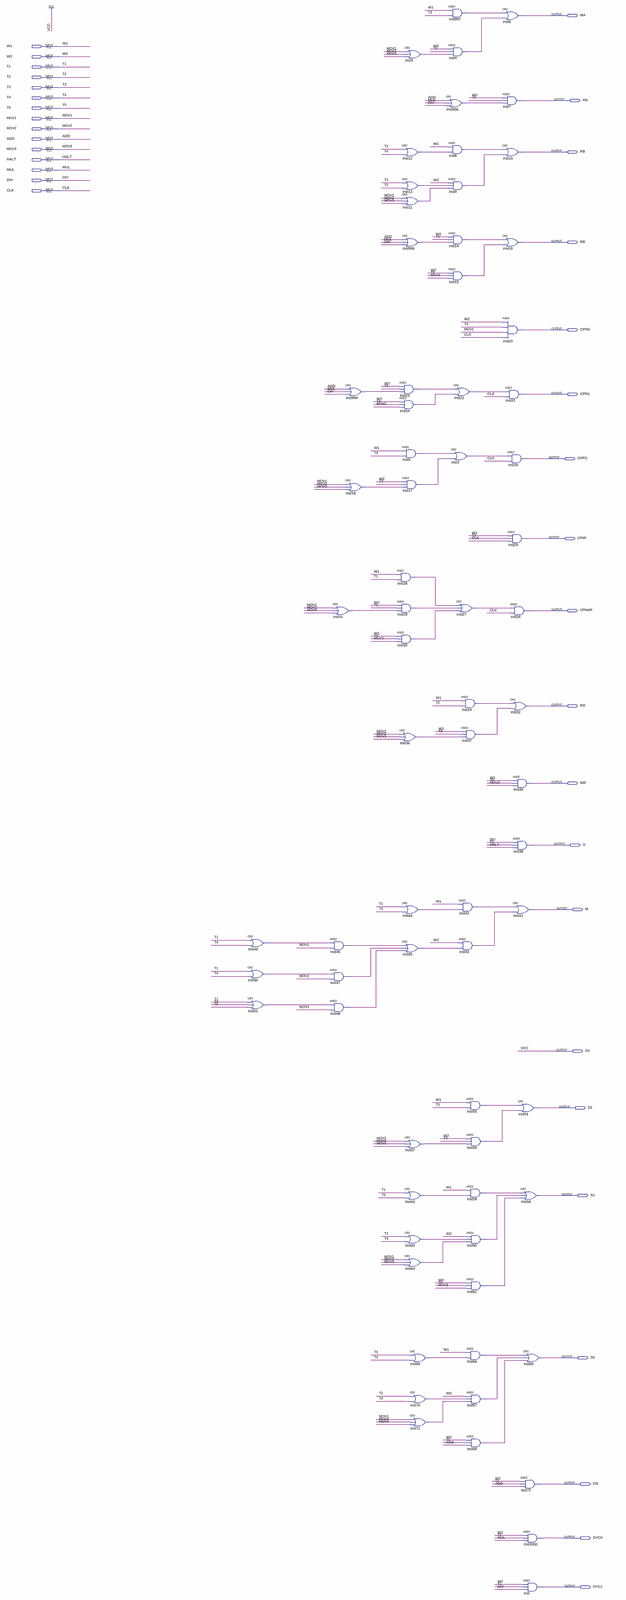
[diagram p0: schematic sheet, whole]
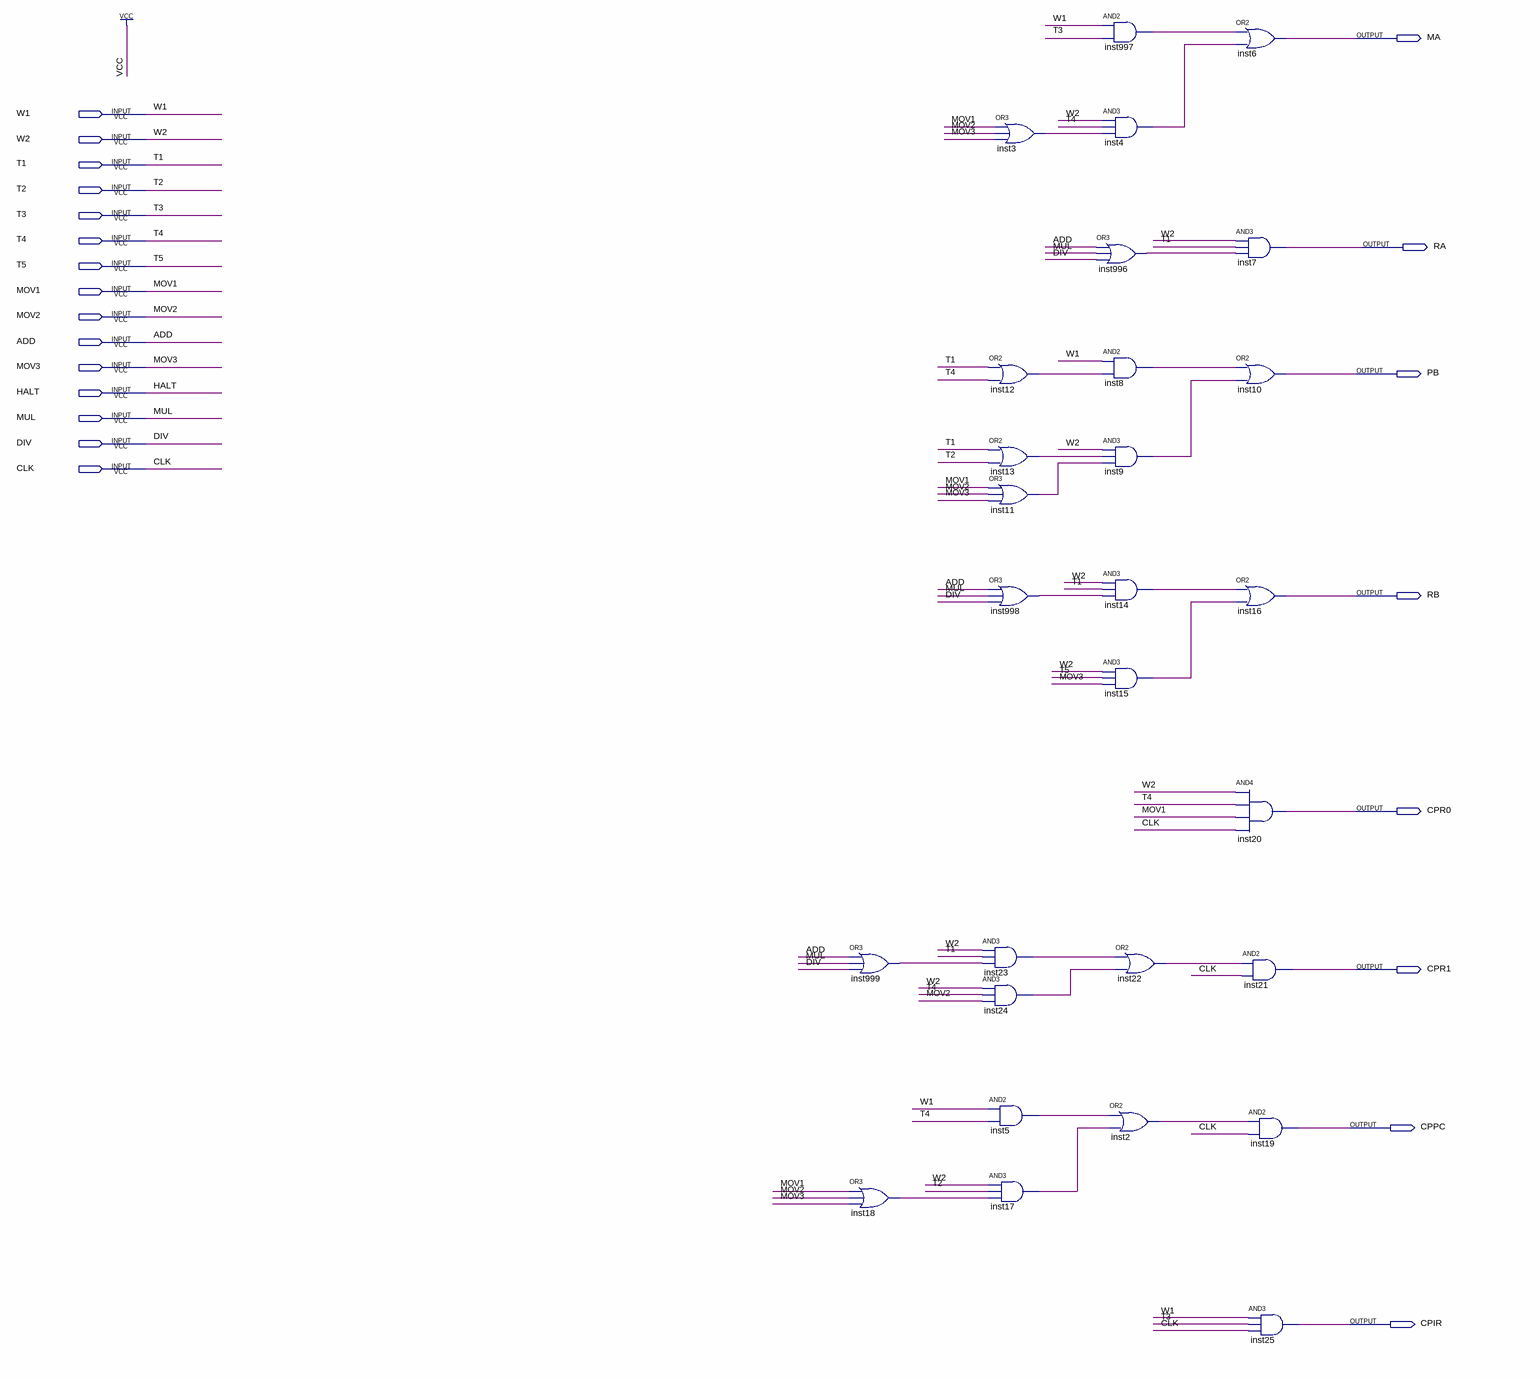
[diagram p1: schematic sheet, upper part]
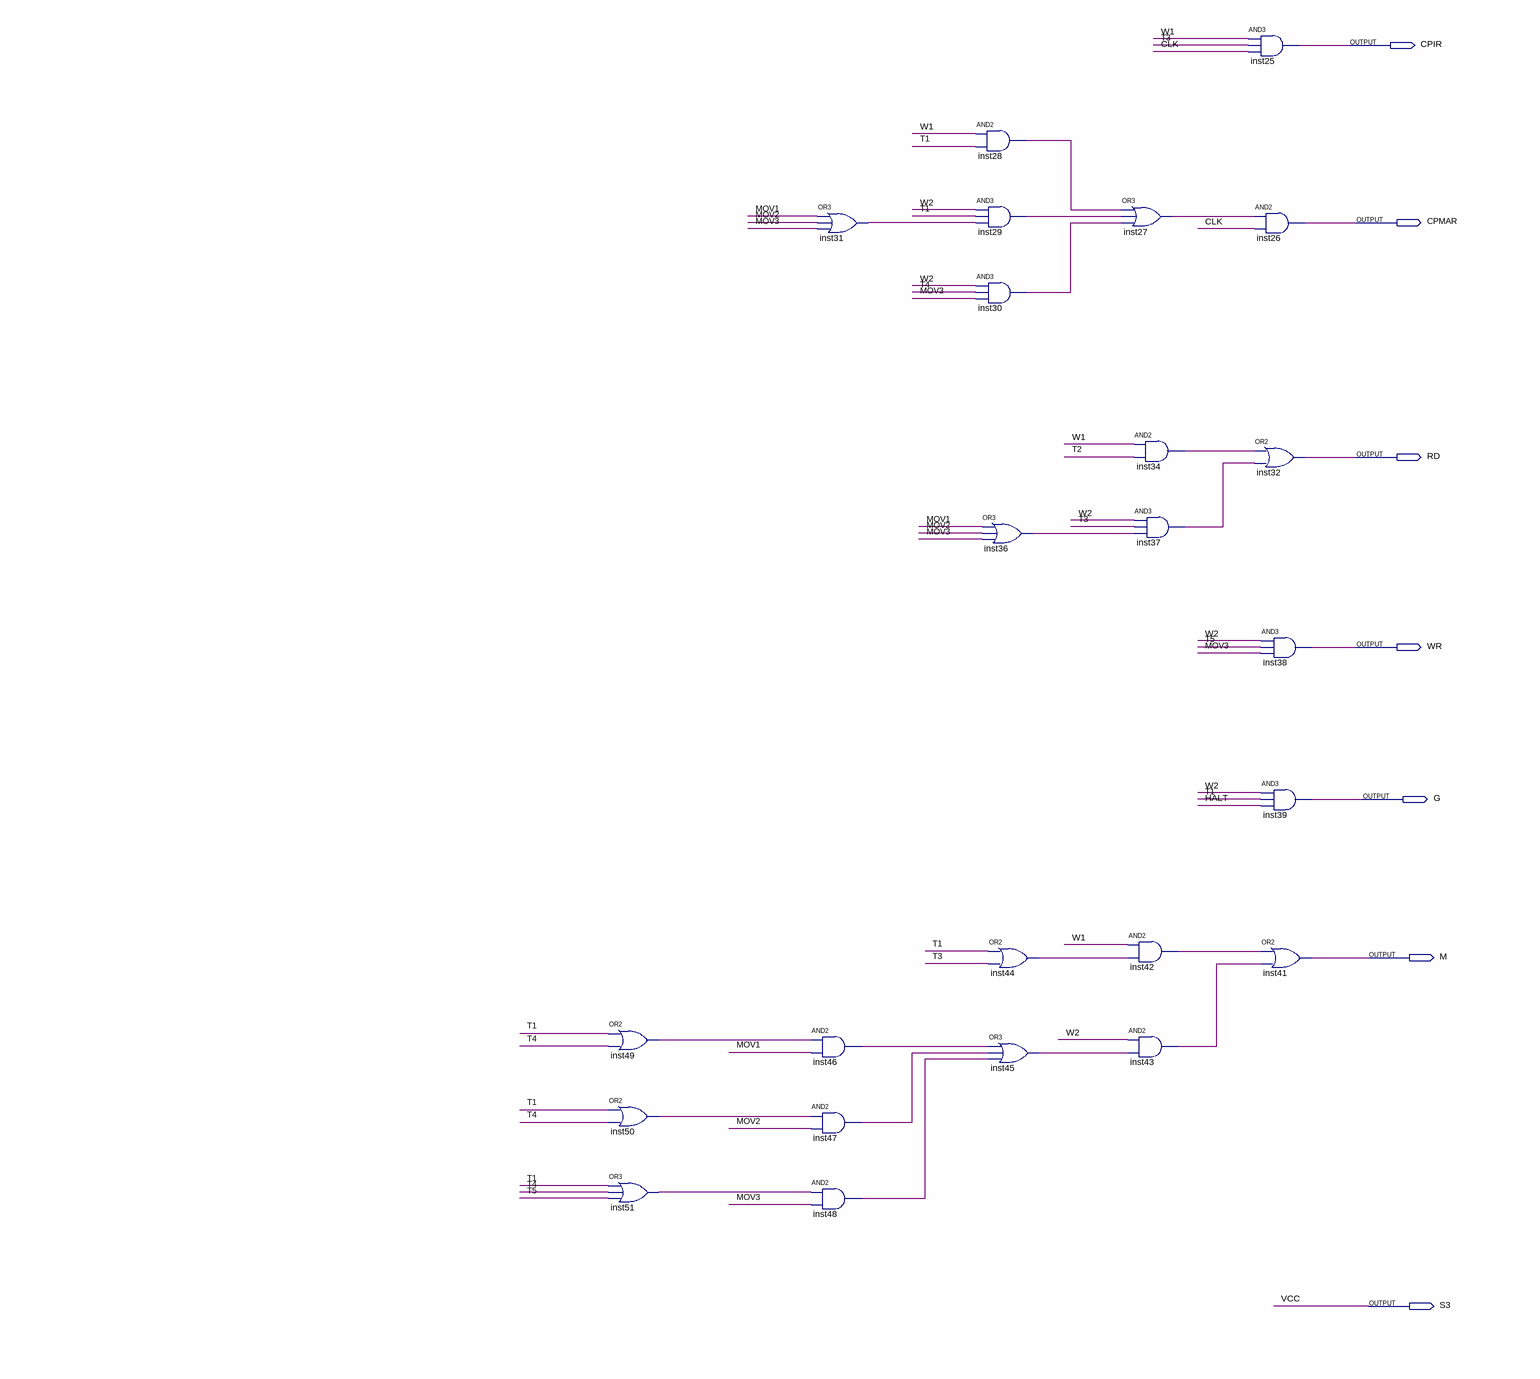
[diagram p2: schematic sheet, middle part]
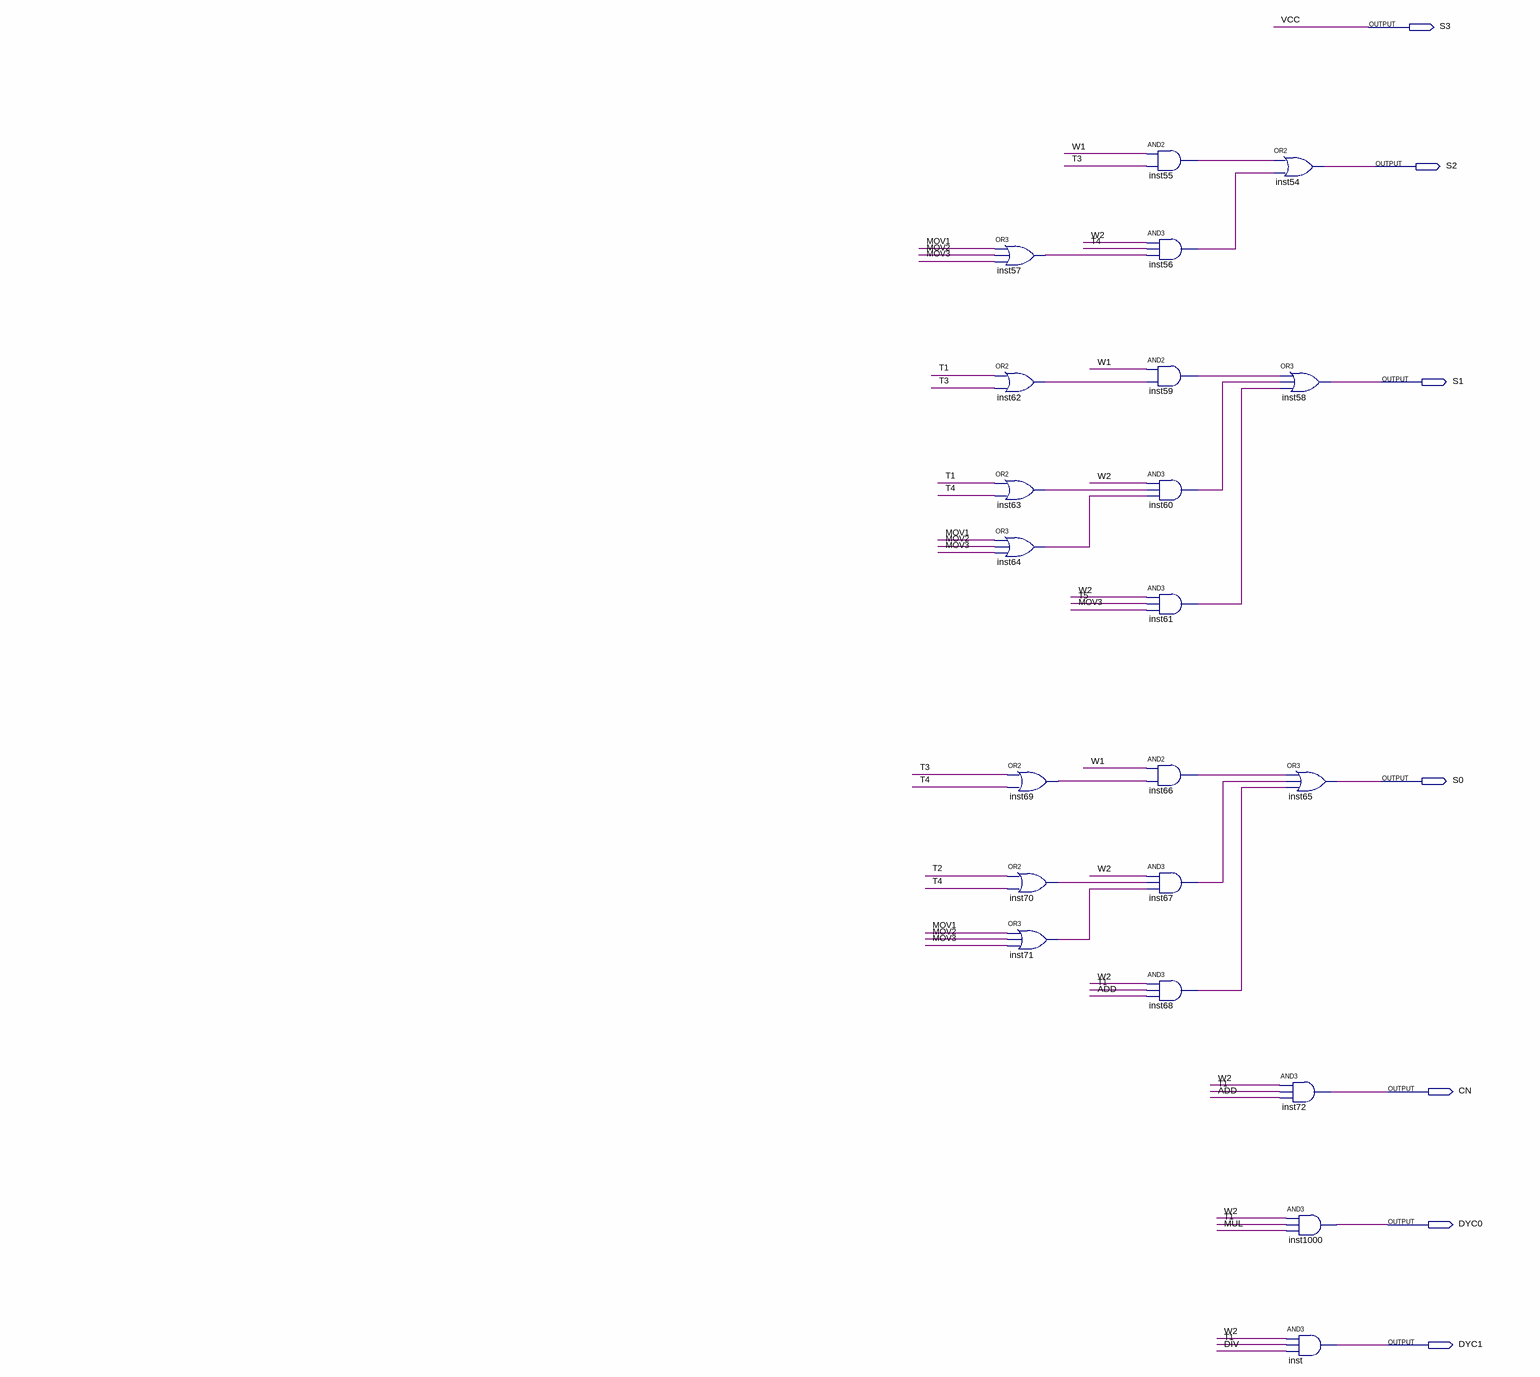
[diagram p3: schematic sheet, lower part]
// Quartus schematic control.bdf as structural Verilog: 72 symbols, 35 pins
module control (
  input  W1,
  input  W2,
  input  T1,
  input  T2,
  input  T3,
  input  T4,
  input  T5,
  input  MOV1,
  input  MOV2,
  input  ADD,
  input  MOV3,
  input  HALT,
  input  MUL,
  input  DIV,
  input  CLK,
  output MA,
  output RA,
  output PB,
  output RB,
  output CPR0,
  output CPR1,
  output CPPC,
  output CPIR,
  output CPMAR,
  output RD,
  output WR,
  output G,
  output M,
  output S3,
  output S2,
  output S1,
  output S0,
  output CN,
  output DYC0,
  output DYC1
);

  wire inst2_out, inst3_out, inst4_out, inst5_out, inst8_out, inst9_out, inst11_out, inst12_out, inst13_out,
       inst14_out, inst15_out, inst17_out, inst18_out, inst22_out, inst23_out, inst24_out, inst27_out,
       inst28_out, inst29_out, inst30_out, inst31_out, inst34_out, inst36_out, inst37_out, inst42_out,
       inst43_out, inst44_out, inst45_out, inst46_out, inst47_out, inst48_out, inst49_out, inst50_out,
       inst51_out, inst55_out, inst56_out, inst57_out, inst59_out, inst60_out, inst61_out, inst62_out,
       inst63_out, inst64_out, inst66_out, inst67_out, inst68_out, inst69_out, inst70_out, inst71_out,
       inst996_out, inst997_out, inst998_out, inst999_out;

  or inst49 (inst49_out, T1, T4);
  or inst50 (inst50_out, T1, T4);
  or inst51 (inst51_out, T1, T4, T5);
  or inst31 (inst31_out, MOV1, MOV2, MOV3);
  and inst46 (inst46_out, inst49_out, MOV1);
  and inst47 (inst47_out, inst50_out, MOV2);
  and inst48 (inst48_out, inst51_out, MOV3);
  or inst999 (inst999_out, ADD, MUL, DIV);
  or inst18 (inst18_out, MOV1, MOV2, MOV3);
  or inst12 (inst12_out, T1, T4);
  or inst13 (inst13_out, T1, T2);
  or inst11 (inst11_out, MOV1, MOV2, MOV3);
  or inst998 (inst998_out, ADD, MUL, DIV);
  and inst23 (inst23_out, W2, T1, inst999_out);
  and inst24 (inst24_out, W2, T4, MOV2);
  and inst5 (inst5_out, W1, T4);
  and inst17 (inst17_out, W2, T2, inst18_out);
  and inst28 (inst28_out, W1, T1);
  and inst29 (inst29_out, W2, T1, inst31_out);
  and inst30 (inst30_out, W2, T4, MOV3);
  or inst36 (inst36_out, MOV1, MOV2, MOV3);
  or inst44 (inst44_out, T1, T3);
  or inst45 (inst45_out, inst46_out, inst47_out, inst48_out);
  or inst3 (inst3_out, MOV1, MOV2, MOV3);
  or inst57 (inst57_out, MOV1, MOV2, MOV3);
  or inst62 (inst62_out, T1, T3);
  or inst63 (inst63_out, T1, T4);
  or inst64 (inst64_out, MOV1, MOV2, MOV3);
  or inst69 (inst69_out, T3, T4);
  or inst70 (inst70_out, T2, T4);
  or inst71 (inst71_out, MOV1, MOV2, MOV3);
  and inst997 (inst997_out, W1, T3);
  and inst4 (inst4_out, W2, T4, inst3_out);
  or inst996 (inst996_out, ADD, MUL, DIV);
  and inst8 (inst8_out, W1, inst12_out);
  and inst9 (inst9_out, W2, inst13_out, inst11_out);
  and inst14 (inst14_out, W2, T1, inst998_out);
  and inst15 (inst15_out, W2, T5, MOV3);
  or inst22 (inst22_out, inst23_out, inst24_out);
  or inst2 (inst2_out, inst5_out, inst17_out);
  or inst27 (inst27_out, inst28_out, inst29_out, inst30_out);
  and inst34 (inst34_out, W1, T2);
  and inst37 (inst37_out, W2, T3, inst36_out);
  and inst42 (inst42_out, W1, inst44_out);
  and inst43 (inst43_out, W2, inst45_out);
  and inst55 (inst55_out, W1, T3);
  and inst56 (inst56_out, W2, T4, inst57_out);
  and inst59 (inst59_out, W1, inst62_out);
  and inst60 (inst60_out, W2, inst63_out, inst64_out);
  and inst61 (inst61_out, W2, T5, MOV3);
  and inst66 (inst66_out, W1, inst69_out);
  and inst67 (inst67_out, W2, inst70_out, inst71_out);
  and inst68 (inst68_out, W2, T1, ADD);
  or inst6 (MA, inst997_out, inst4_out);
  and inst7 (RA, W2, T1, inst996_out);
  or inst10 (PB, inst8_out, inst9_out);
  or inst16 (RB, inst14_out, inst15_out);
  and inst20 (CPR0, W2, T4, MOV1, CLK);
  and inst21 (CPR1, inst22_out, CLK);
  and inst19 (CPPC, inst2_out, CLK);
  and inst25 (CPIR, W1, T3, CLK);
  and inst26 (CPMAR, inst27_out, CLK);
  or inst32 (RD, inst34_out, inst37_out);
  and inst38 (WR, W2, T5, MOV3);
  and inst39 (G, W2, T1, HALT);
  or inst41 (M, inst42_out, inst43_out);
  or inst54 (S2, inst55_out, inst56_out);
  or inst58 (S1, inst59_out, inst60_out, inst61_out);
  or inst65 (S0, inst66_out, inst67_out, inst68_out);
  and inst72 (CN, W2, T1, ADD);
  and inst1000 (DYC0, W2, T1, MUL);
  and inst (DYC1, W2, T1, DIV);

  assign S3 = 1'b1;
endmodule
